# EasyEDA Pro project CH32V307VCT6开源最小系统.eprj, board PCB1
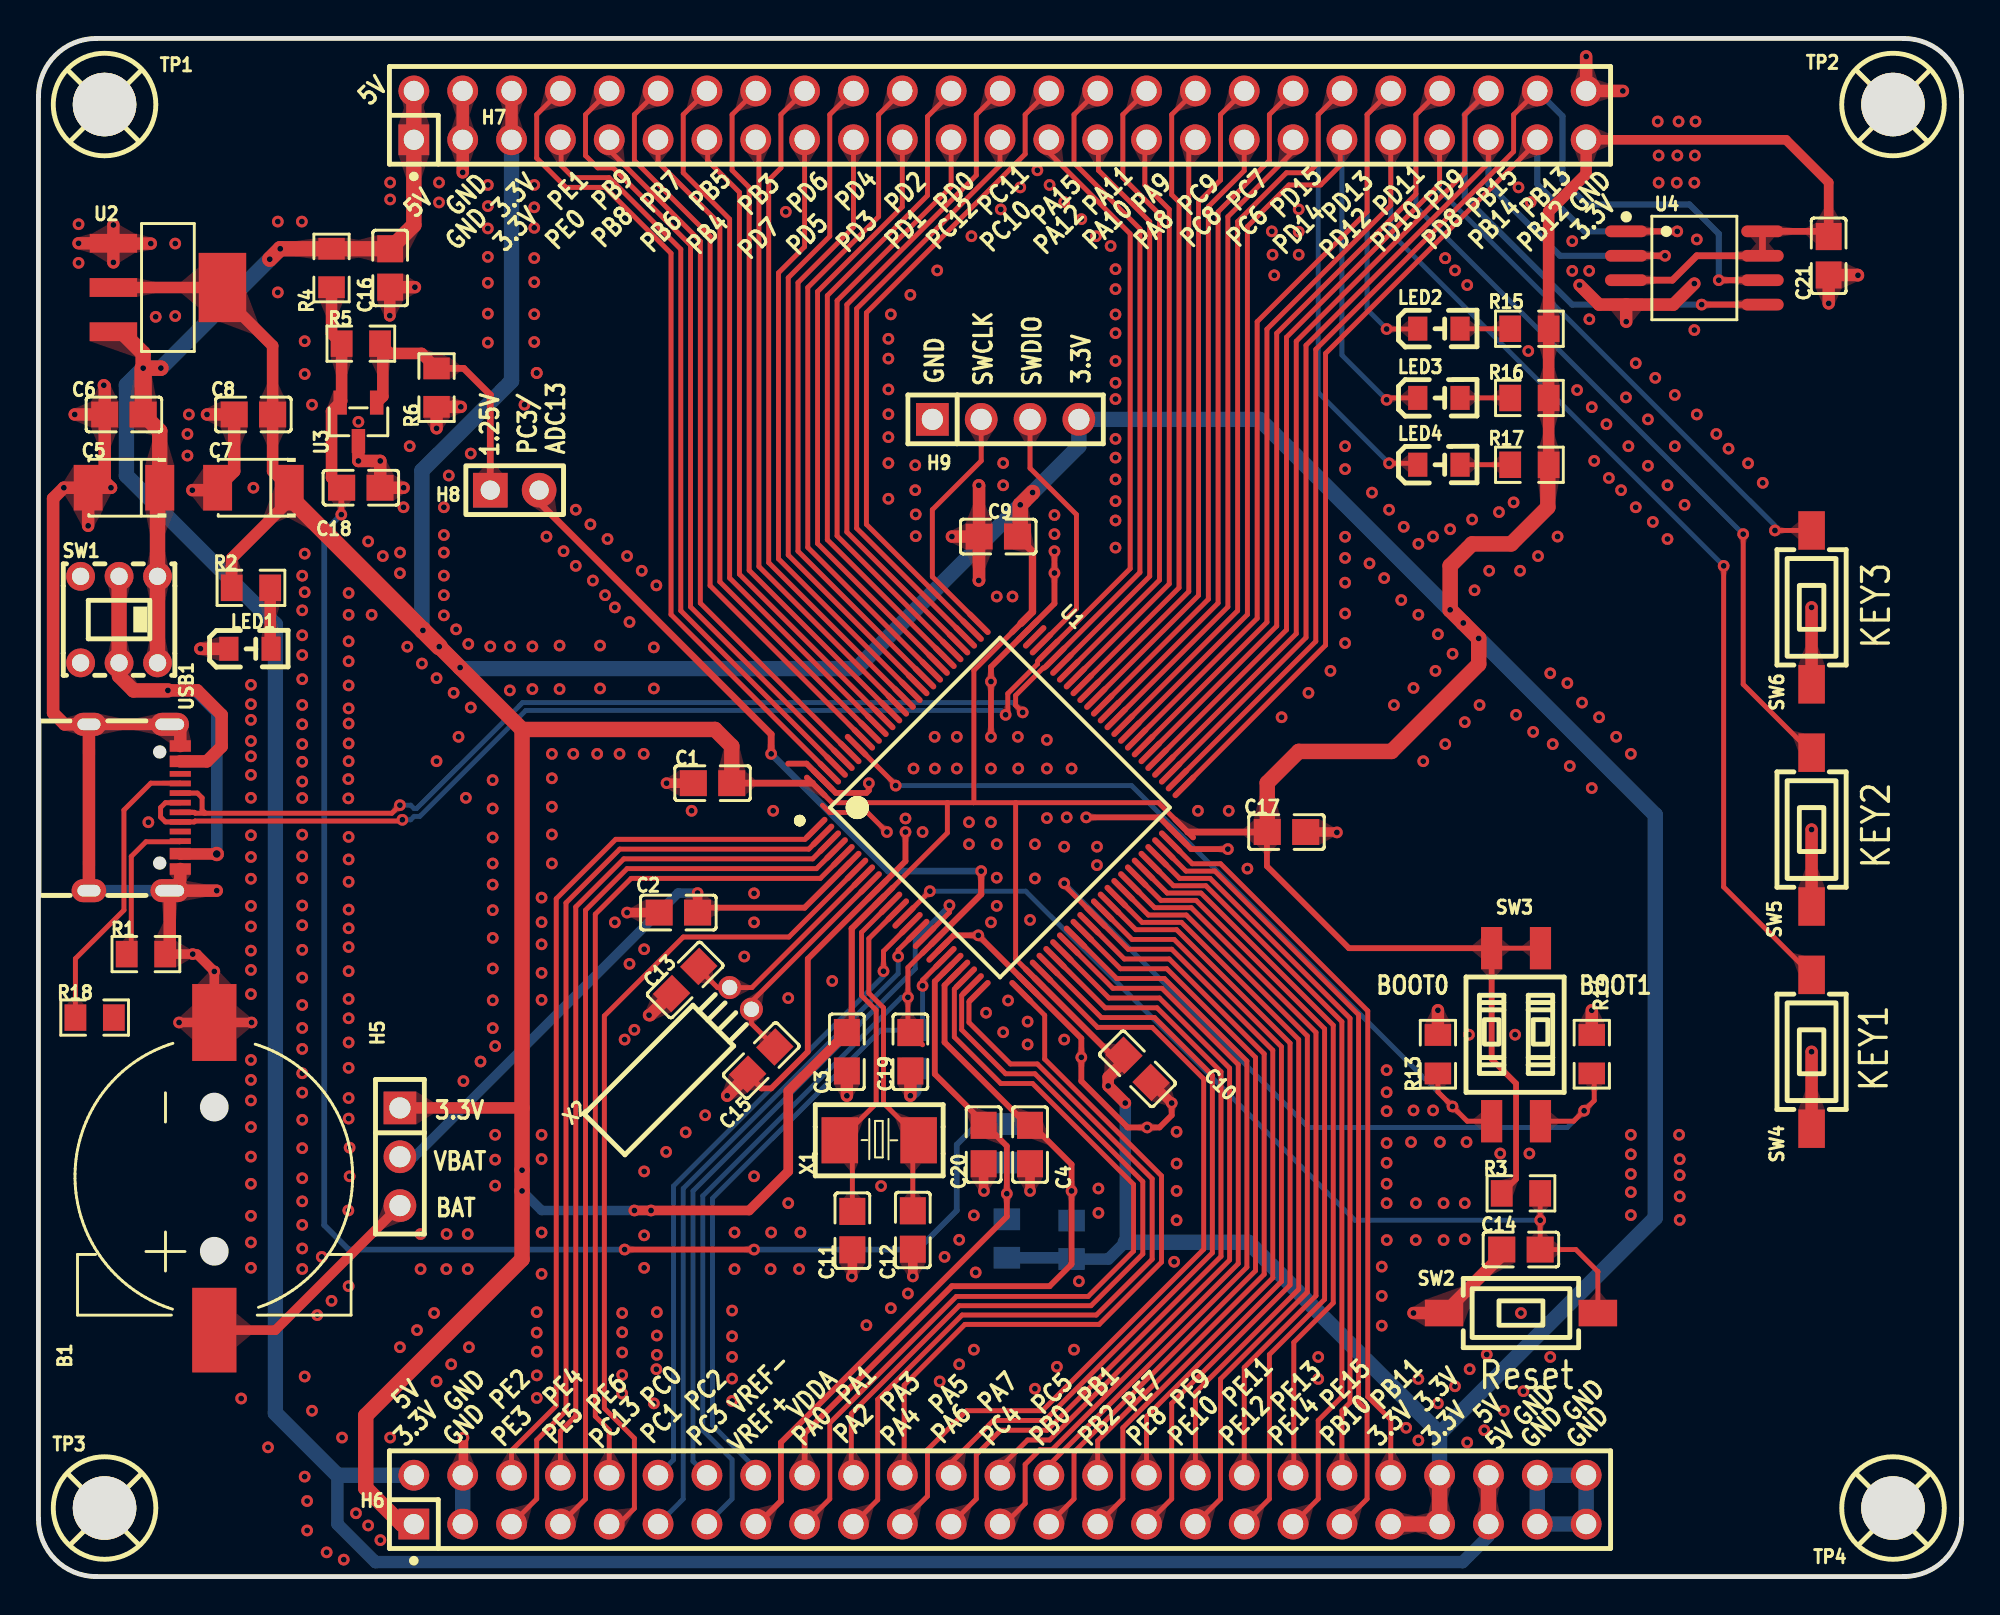
[diagram p1: board, top side]
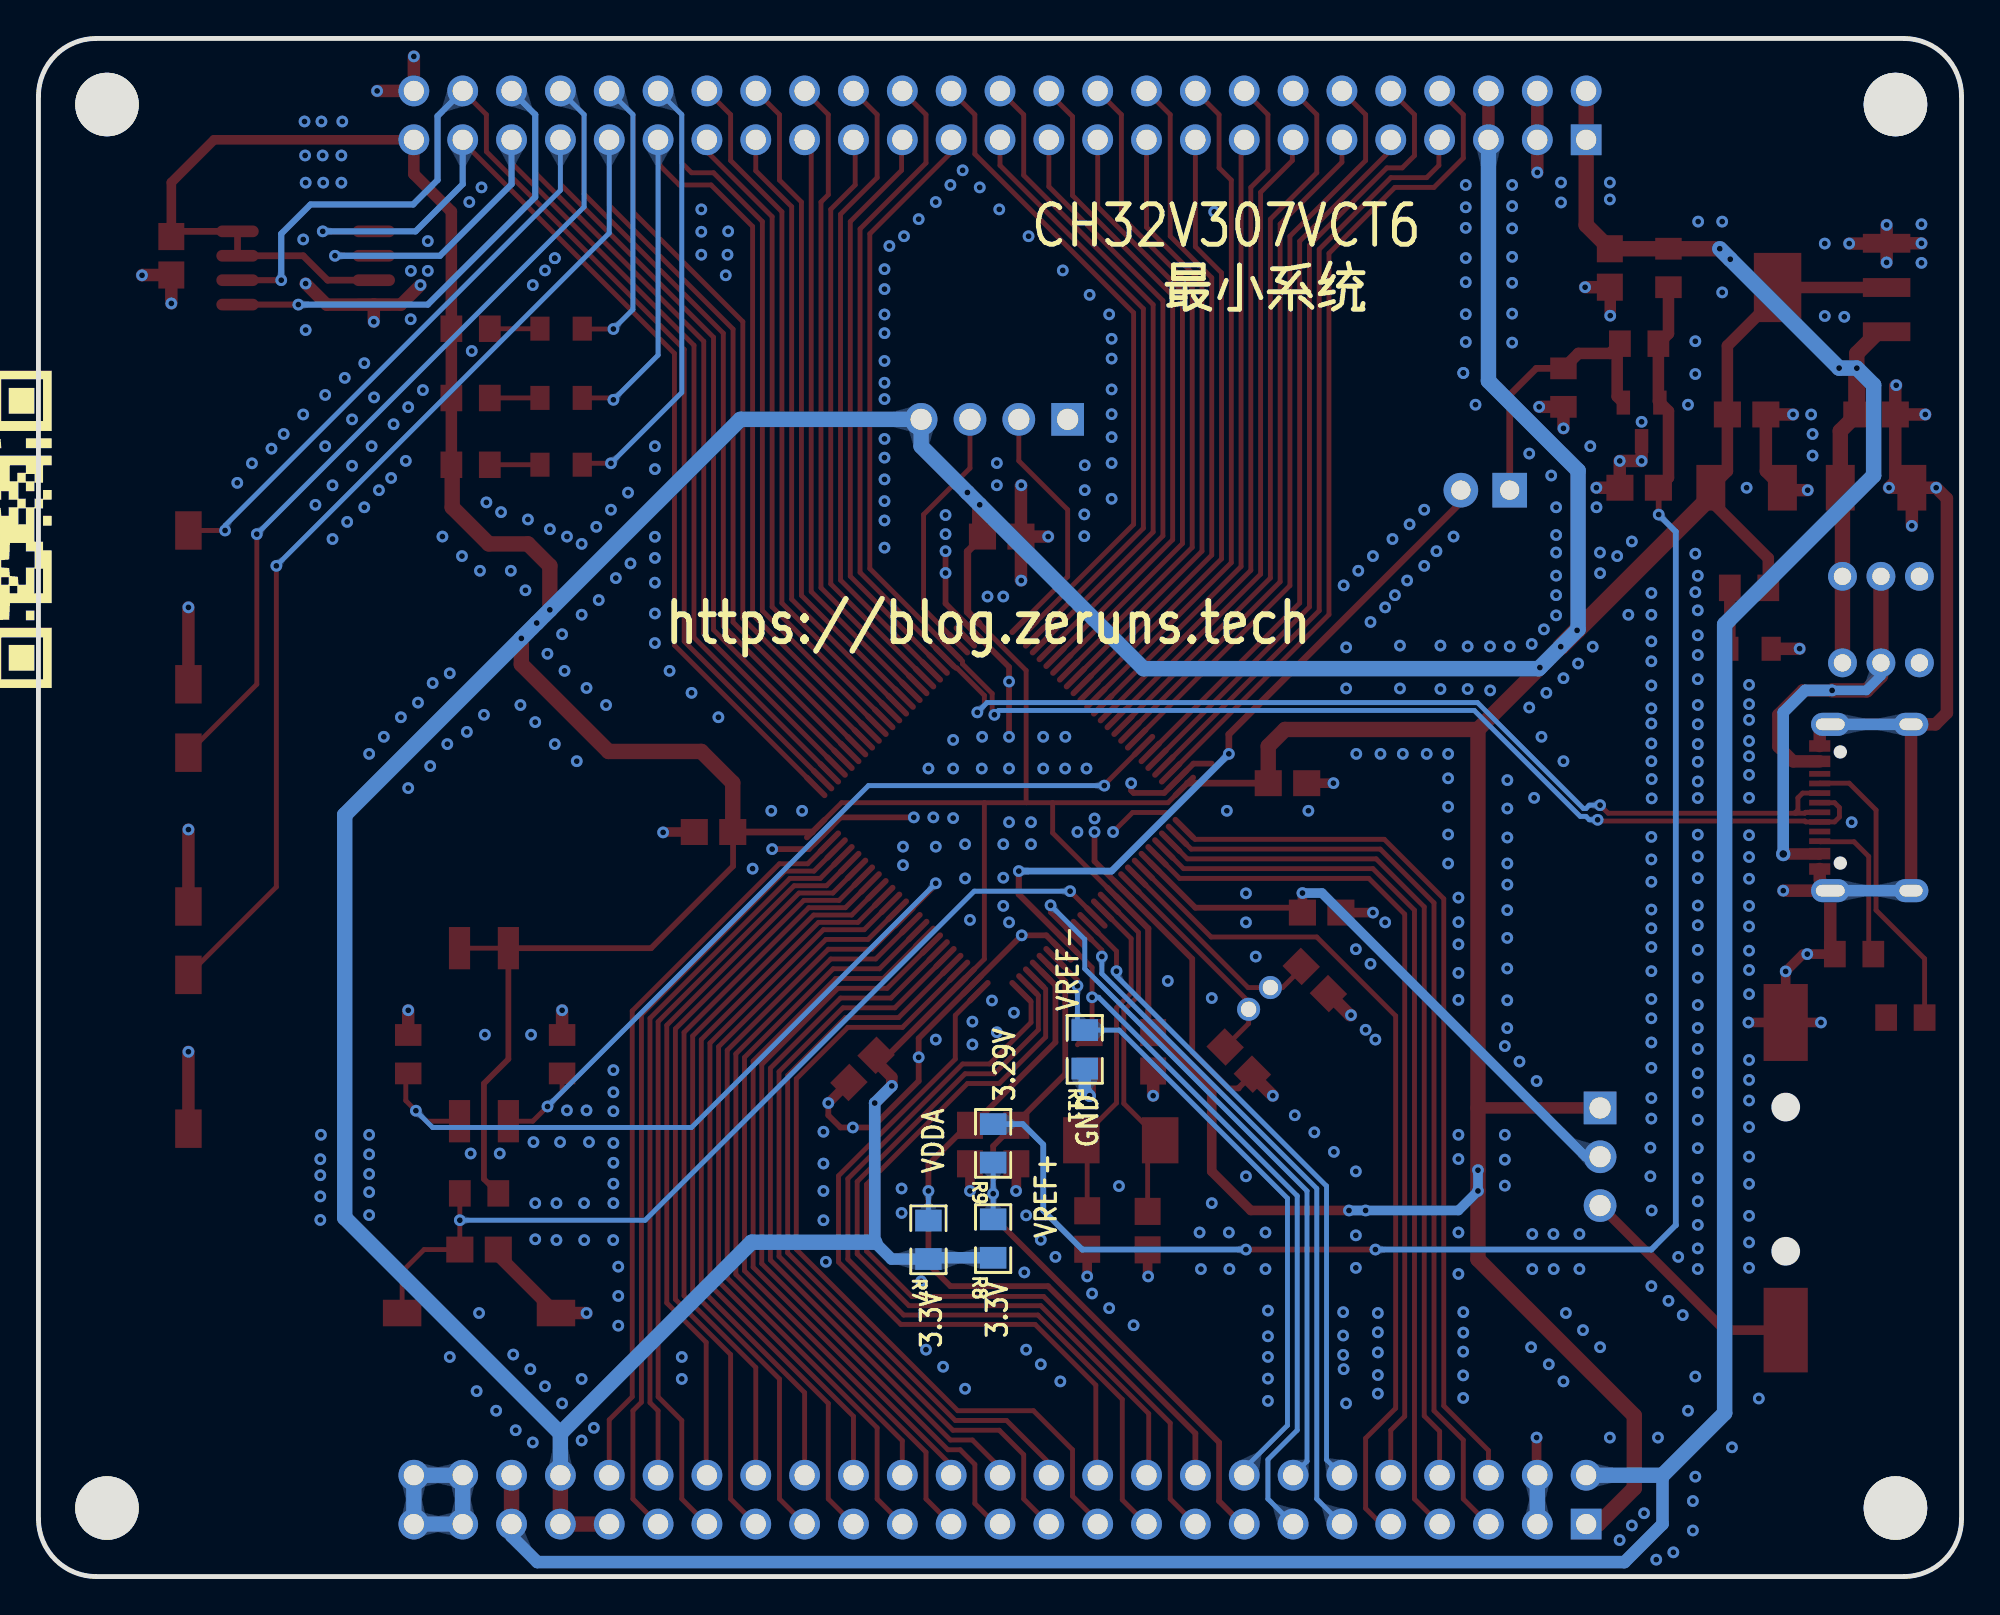
[diagram p2: board, bottom side, seen from below]

Outline 100 x 80 mm; copper layers: Top Layer, Bottom Layer. Coordinates in mm from the lower left corner of the outline.
Outline path: 0,77 0,3 arc(0.88,0.88) 3,0 97,0 arc(99.12,0.88) 100,3 100,77 arc(99.12,79.12) 97,80 3,80 arc(0.88,79.12) 0,77
Stack: Top Layer 0.035mm / Dielectric1 1.51mm FR4 er 4.5 / Bottom Layer 0.035mm

## Design rules (mm)
template: 自定义配置
spacing copperThickness1oz (default): track to track 0.102, other pairs 0.152 to 0.3
spacing copperThickness2oz: track to track 0.203, other pairs 0.152 to 0.3
track width copperThickness1oz (default): min 0.127, default 0.254, max 2.54
track width copperThickness2oz: min 0.203, default 0.254, max 2.54
differential pair differentialPair (default): width min 0.127, default 0.254, max 2.54; gap min 0.152, default 0.152
via viaSize (default): diameter min 0.5, default 0.61, max 10; hole min 0.3, default 0.305, max 6.3

## Placement (name value [footprint] x y rotation side)
B1  CR1220-2  [BAT-SMD_CR1220-2]  9.14 20.82 90 top
C1  100nF  [C0805]  35.05 41.27 0 top
C2  100nF  [C0805]  33.27 34.53 0 top
C3  100nF  [C0805]  42.04 27.3 90 top
C4  100nF  [C0805]  51.56 22.47 90 top
C5  47uF  [CASE-B_3528]  4.44 56.63 180 top
C6  100nF  [C0805]  4.44 60.44 0 top
C7  47uF  [CASE-B_3528]  11.18 56.63 180 top
C8  100nF  [C0805]  11.18 60.44 0 top
C9  100nF  [C0805]  49.91 54.09 0 top
C10  100nF  [C0805]  57.15 26.41 135 top
C11  20pF  [C0805]  42.32 17.99 90 top
C12  20pF  [C0805]  45.47 18.02 90 top
C13  12pF  [C0805]  33.63 31.03 45 top
C14  100nF  [C0805]  77.09 17.01 0 top
C15  12pF  [C0805]  37.58 26.84 45 top
C16  100nF  [C0805]  18.29 68.06 90 top
C17  100nF  [C0805]  64.9 38.72 180 top
C18  100nF  [C0805]  16.76 56.63 180 top
C19  100nF  [C0805]  45.34 27.3 90 top
C20  100nF  [C0805]  49.15 22.47 90 top
C21  100nF  [C0805]  93.09 68.7 90 top
H5  -  [HDR-TH_3P-P2.54-V-M]  18.8 21.83 270 top
H6  X6521WV-2x25H-C30D60  [HDR-TH_50P-2.54-V-M-R2-C25-S2.54]  50 4 0 top
H7  X6521WV-2x25H-C30D60  [HDR-TH_50P-2.54-V-M-R2-C25-S2.54]  50 76 0 top
H8  -  [HDR-TH_2P-P2.54-V-M-1]  24.77 56.5 0 top
H9  -  [HDR-TH_4P-P2.54-V-M]  50.29 60.19 0 top
LED1  NCD0805R1  [LED_0805]  11.05 48.25 0 top
LED2  NCD0805R1  [LED_0805]  72.87 64.9 0 top
LED3  NCD0805R1  [LED_0805]  72.87 61.3 0 top
LED4  NCD0805R1  [LED_0805]  72.87 57.83 0 top
R1  5.1kΩ  [R0805]  5.59 32.38 0 top
R2  330Ω  [R0805]  11.05 51.42 0 top
R3  10kΩ  [R0805]  77.09 19.93 180 top
R4  470Ω  [R0805]  15.24 68.06 270 top
R5  1.8K  [R0805]  16.76 64.12 180 top
R6  1.1K  [R0805]  20.7 61.84 90 top
R7  0Ω  [R0805]  53.72 17.52 90 bottom
R8  0Ω  [R0805]  50.36 17.58 90 bottom
R9  0Ω  [R0805]  50.36 22.53 90 bottom
R11  0Ω  [R0805]  45.59 27.42 90 bottom
R13  10kΩ  [R0805]  72.77 27.17 270 top
R14  10kΩ  [R0805]  80.77 27.17 270 top
R15  330Ω  [R0805]  77.53 64.9 180 top
R16  330Ω  [R0805]  77.53 61.3 180 top
R17  330Ω  [R0805]  77.53 57.83 180 top
R18  5.1kΩ  [R0805]  2.92 29.07 0 top
SW1  PS-5850A-6PL  [SW-TH_6P-L5.8-W5.8-P2.00-LS4.5-BL]  4.19 49.77 0 top
SW2  TSA363G25-250B  [SW-SMD_L6.1-W3.6-LS8.0]  77.09 13.71 0 top
SW3  DSIC02LSGET  [SW-SMD_4P-L6.0-W5.1-P2.54-LS9.3-BL]  76.84 28.18 0 top
SW4  TSA363G25-250B  [SW-SMD_L6.1-W3.6-LS8.0]  92.2 27.3 90 top
SW5  TSA363G25-250B  [SW-SMD_L6.1-W3.6-LS8.0]  92.2 38.85 90 top
SW6  TSA363G25-250B  [SW-SMD_L6.1-W3.6-LS8.0]  92.2 50.41 90 top
TP1  -  [m3螺丝]  3.5 76.5 0 top
TP2  -  [m3螺丝]  96.5 76.5 0 top
TP3  -  [m3螺丝]  3.5 3.5 0 top
TP4  -  [m3螺丝]  96.5 3.5 0 top
U1  CH32V307VCT6  [LQFP-100_L14.0-W14.0-P0.50-LS16.0-BL]  50 40 315 top
U2  AMS1117-3.3  [SOT-223-4_L6.5-W3.5-P2.30-LS7.0-BR]  6.73 67.05 180 top
U3  TL432  [SOT-23-3_L2.9-W1.3-P1.90-LS2.4-BR]  16.64 60.06 90 top
U4  W25Q64JVSSIQ  [SOP-8_L5.3-W5.3-P1.27-LS8.0-BL]  86.11 68.06 270 top
USB1  TYPE-C 16PIN 2MD(073)  [USB-C-SMD_TYPE-C-6PIN-2MD-073]  5 40 270 top
X1  8MHz  [CRYSTAL-SMD_L5.0-W3.2]  43.72 22.69 180 top
X2  32.768kHz  [OSC-TH_BD3.1-P0.8-D0.3]  36.51 30.07 45 top

## Footprints (pads in the part's own frame, mm; a bottom-side part is the same pattern mirrored in y, then rotated)
BAT-SMD_CR1220-2
  rect 4.4x2.3 smd: 1(-8,0)
  rect 4x2.3 smd: 2(8,0)
C0805
  rect 1.41x1.35 smd: 1(-1,0) 2(1,0)
CASE-B_3528
  rect 1.506x2.376 smd: 1(-1.861,0) 2(1.861,0)
CRYSTAL-SMD_L5.0-W3.2
  rect 1.9x2.4 smd: 1(-2.05,0) 2(2.05,0)
HDR-TH_2P-P2.54-V-M-1
  rect 1.8x1.8 hole 1: 1(-1.27,0)
  round 1.8 hole 1: 2(1.27,0)
HDR-TH_3P-P2.54-V-M
  rect 1.7x1.7 hole 1.1: 1(-2.54,0)
  round 1.7 hole 1.1: 2(0,0) 3(2.54,0)
HDR-TH_4P-P2.54-V-M
  rect 1.7x1.7 hole 1.1: 1(-3.81,0)
  round 1.7 hole 1.1: 2(-1.27,0) 3(1.27,0) 4(3.81,0)
HDR-TH_50P-2.54-V-M-R2-C25-S2.54
  rect 1.6x1.6 hole 1.05: 1(-30.48,-1.27)
  round 1.6 hole 1.05: 2(-30.48,1.27) 3(-27.94,-1.27) 4(-27.94,1.27) 5(-25.4,-1.27) 6(-25.4,1.27) 7(-22.86,-1.27) 8(-22.86,1.27) 9(-20.32,-1.27) 10(-20.32,1.27) 11(-17.78,-1.27) 12(-17.78,1.27) 13(-15.24,-1.27) 14(-15.24,1.27) 15(-12.7,-1.27) 16(-12.7,1.27) 17(-10.16,-1.27) 18(-10.16,1.27) 19(-7.62,-1.27) 20(-7.62,1.27) 21(-5.08,-1.27) 22(-5.08,1.27) 23(-2.54,-1.27) 24(-2.54,1.27) 25(0,-1.27) 26(0,1.27) 27(2.54,-1.27) 28(2.54,1.27) 29(5.08,-1.27) 30(5.08,1.27) 31(7.62,-1.27) 32(7.62,1.27) 33(10.16,-1.27) 34(10.16,1.27) 35(12.7,-1.27) 36(12.7,1.27) 37(15.24,-1.27) 38(15.24,1.27) 39(17.78,-1.27) 40(17.78,1.27) 41(20.32,-1.27) 42(20.32,1.27) 43(22.86,-1.27) 44(22.86,1.27) 45(25.4,-1.27) 46(25.4,1.27) 47(27.94,-1.27) 48(27.94,1.27) 49(30.48,-1.27) 50(30.48,1.27)
LED_0805
  rect 1x1.25 smd: 1(-1.15,0.005) 2(1.05,0.005)
LQFP-100_L14.0-W14.0-P0.50-LS16.0-BL
  oval 0.3x1.6 smd: 1(-6,-7.55) 2(-5.5,-7.55) 3(-5,-7.55) 4(-4.5,-7.55) 5(-4,-7.55) 6(-3.5,-7.55) 7(-3,-7.55) 8(-2.5,-7.55) 9(-2,-7.55) 10(-1.5,-7.55) 11(-1,-7.55) 12(-0.5,-7.55) 13(0,-7.55) 14(0.5,-7.55) 15(1,-7.55) 16(1.5,-7.55) 17(2,-7.55) 18(2.5,-7.55) 19(3,-7.55) 20(3.5,-7.55) 21(4,-7.55) 22(4.5,-7.55) 23(5,-7.55) 24(5.5,-7.55) 25(6,-7.55) 51(6,7.55) 52(5.5,7.55) 53(5,7.55) 54(4.5,7.55) 55(4,7.55) 56(3.5,7.55) 57(3,7.55) 58(2.5,7.55) 59(2,7.55) 60(1.5,7.55) 61(1,7.55) 62(0.5,7.55) 63(0,7.55) 64(-0.5,7.55) 65(-1,7.55) 66(-1.5,7.55) 67(-2,7.55) 68(-2.5,7.55) 69(-3,7.55) 70(-3.5,7.55) 71(-4,7.55) 72(-4.5,7.55) 73(-5,7.55) 74(-5.5,7.55) 75(-6,7.55)
  oval 1.6x0.3 smd: 26(7.55,-6) 27(7.55,-5.5) 28(7.55,-5) 29(7.55,-4.5) 30(7.55,-4) 31(7.55,-3.5) 32(7.55,-3) 33(7.55,-2.5) 34(7.55,-2) 35(7.55,-1.5) 36(7.55,-1) 37(7.55,-0.5) 38(7.55,0) 39(7.55,0.5) 40(7.55,1) 41(7.55,1.5) 42(7.55,2) 43(7.55,2.5) 44(7.55,3) 45(7.55,3.5) 46(7.55,4) 47(7.55,4.5) 48(7.55,5) 49(7.55,5.5) 50(7.55,6) 76(-7.55,6) 77(-7.55,5.5) 78(-7.55,5) 79(-7.55,4.5) 80(-7.55,4) 81(-7.55,3.5) 82(-7.55,3) 83(-7.55,2.5) 84(-7.55,2) 85(-7.55,1.5) 86(-7.55,1) 87(-7.55,0.5) 88(-7.55,0) 89(-7.55,-0.5) 90(-7.55,-1) 91(-7.55,-1.5) 92(-7.55,-2) 93(-7.55,-2.5) 94(-7.55,-3) 95(-7.55,-3.5) 96(-7.55,-4) 97(-7.55,-4.5) 98(-7.55,-5) 99(-7.55,-5.5) 100(-7.55,-6)
m3螺丝
  round 3.3 hole 3.3: 1(-0.064,0.064)
OSC-TH_BD3.1-P0.8-D0.3
  round 1.2 hole 0.8: 1(0,0.8) 2(0,-0.8)
R0805
  rect 1.133x1.377 smd: 1(-1,0) 2(1,0)
SOP-8_L5.3-W5.3-P1.27-LS8.0-BL
  oval 0.609x2.204 smd: 1(-1.905,-3.542) 2(-0.635,-3.542) 3(0.635,-3.542) 4(1.905,-3.542) 5(1.905,3.542) 6(0.635,3.542) 7(-0.635,3.542) 8(-1.905,3.542)
SOT-23-3_L2.9-W1.3-P1.90-LS2.4-BR
  rect 1.25x0.7 smd: 1(1,-0.95) 2(1,0.95) 3(-1,0)
SOT-223-4_L6.5-W3.5-P2.30-LS7.0-BR
  rect 2.47x0.98 smd: 1(2.835,-2.3) 2(2.835,0) 3(2.835,2.3)
  rect 2.47x3.6 smd: 4(-2.835,0)
SW-SMD_4P-L6.0-W5.1-P2.54-LS9.3-BL
  rect 1.1x2.2 smd: 1(-1.27,-4.5) 2(1.27,-4.5) 3(1.27,4.5) 4(-1.27,4.5)
SW-SMD_L6.1-W3.6-LS8.0
  rect 2x1.38 smd: 1(-4,0) 2(4,0)
SW-TH_6P-L5.8-W5.8-P2.00-LS4.5-BL
  round 1.5 hole 0.9: 1(-2,-2.25) 2(0,-2.25) 3(2,-2.25) 4(-2,2.25) 5(0,2.25) 6(2,2.25)
USB-C-SMD_TYPE-C-6PIN-2MD-073
  rect 0.6x1.1 smd: 1(-3.2,2.375) 2(-2.4,2.375) 11(2.4,2.375) 12(3.2,2.375)
  rect 0.3x1.1 smd: 3(-1.75,2.375) 4(-1.25,2.375) 5(-0.75,2.375) 6(-0.25,2.375) 7(0.25,2.375) 8(0.75,2.375) 9(1.25,2.375) 10(1.75,2.375)
  oval 1.2x2 hole 0.6x1.5: 13(-4.325,1.825) 14(4.325,1.825)
  oval 1.2x1.8 hole 0.6x1.2: 13(-4.325,-2.375) 14(4.325,-2.375)

## Nets
As in the schematic.

Pads without a net: SW1 1 4; TP1 1; TP2 1; TP3 1; TP4 1; U1 73; USB1 3 9

## Via types
v1: diameter 0.61, hole 0.305, Top Layer to Bottom Layer, 651 vias
v2: diameter 0.75, hole 0.4, Top Layer to Bottom Layer, 1 via

## Routing (per net, layer and track width the routed paths; a pad name or vN(x,y) marks a point on that pad's centre or on a via; arc(x,y) is an arc through that point)
1.25V: length 15.5
  Top Layer w0.35: R6.2 22.11,62.84 23.5,61.46 23.5,55.87
  Top Layer w0.6: 17.91,63.98 17.91,61.38 U3.1 ; 17.91,63.98 R5.1 ; 17.91,63.98 18.27,63.62 19.92,63.62 R6.2
3.29V: length 90.5
  Top Layer w0.3: v1(15.75,55.23) 15.75,56.62 C18.2 ; v1(37.21,17.01) v1(30.48,17.01)
  Top Layer w0.6: C18.2 15.24,57.16 15.24,60.61 U3.2 15.76,61.14 R5.2 15.24,64.65 R4.2
  Bottom Layer w0.3: R9.2 48.82,23.53 47.75,22.47 47.75,19.04 45.72,17.01 v1(37.21,17.01) ; v1(30.48,17.01) 16.13,17.01 14.86,18.28 14.86,54.35 v1(15.75,55.23)
+3.3V: length 509.6
  Top Layer w0.254: U1.28 50.81,32.12 50.81,40.25 ; 78.1,32.68 SW3.4 ; U1.11 47.26,38.68 47.26,40.25 ; 48.62,40.25 50.81,40.25 ; 48.62,40.25 48.64,40.27 48.64,47.13 51.1,49.58 ; 48.62,40.25 47.26,40.25 ; 50.81,40.25 58.24,40.25 59.58,38.9 ; 40.42,41.1 41.27,40.25 47.26,40.25
  Top Layer w0.3: C17.2 63.88,38.71 63.88,36.95 68.14,32.68 SW3.4 75.56,26.91 76.84,25.64 76.84,20.68 R3.2
  Top Layer w0.32: U1.28 55.98,26.95 56.6,26.95 ; 42.29,28.3 42.29,33.7 U1.11
  Top Layer w0.35: 82.56,67.43 84.96,67.43 86.23,68.7 U4.7 U4.8 92.57,69.97 93.09,69.44 ; 59.76,38.72 C17.2 ; C1.2 40.25,41.27
  Top Layer w0.38: C9.2 51.69,53.31 51.69,50.17 51.1,49.58
  Top Layer w0.5: v1(30.99,19.04) v1(31.85,19.04) 36.96,19.04 38.99,21.07 38.99,25.25 C3.2 ; H7.49 90.87,74.73 93.09,72.51 93.09,69.44
  Top Layer w0.6: U2.2 U2.4 9.57,66.62 12.18,64.01 C8.2 12.18,57.49 C7.1 13.04,55.95 10.05,52.97 R2.1 ; R17.1 R16.1 R15.1 78.53,71 80.48,72.95 H7.49 ; 25.15,24.37 H5.1 ; v1(56.51,24.63) v1(55.63,25.52) 55.63,25.98 56.6,26.95
  Top Layer w0.65: H7.5 H7.6
  Top Layer w0.8: C17.2 63.9,41.28 65.53,42.92 70.36,42.92 74.89,47.45 v1(74.89,48.8) v1(74.09,49.6) v1(73.41,50.28) 73.41,52.57 74.55,53.71 76.58,53.71 78.49,55.62 78.49,57.78 R17.1 ; C1.2 36.05,43.19 35.18,44.06 25.15,44.06 ; 25.15,44.06 v1(21.93,47.28) v1(20.84,48.36) ; 25.15,44.06 v1(25.15,21.14) v1(25.15,20.06) 25.15,16.5 17.02,8.37 17.02,4.6 18.89,2.73 H6.1 ; C9.2 51.05,54.23 v1(51.05,55.74) v1(51.7,56.38) ; H6.41 H6.43 H6.44
  Top Layer w0.9: 13.04,56.17 v1(19.99,49.21) v1(20.84,48.36)
  Bottom Layer w0.5: 25.15,21.07 v1(25.15,20.06) 26.16,19.04 v1(30.99,19.04) v1(31.85,19.04)
  Bottom Layer w0.6: v1(55.63,25.52) v1(56.51,24.63) 56.51,17.39 55.64,16.52 R7.1 53.66,16.58 R8.1
  Bottom Layer w0.8: H7.5 24.6,62.18 19.94,57.52 19.94,49.27 20.83,48.38 ; 72.86,7.44 84.07,18.66 84.07,39.61 v1(74.89,48.8) v1(74.09,49.6) v1(73.41,50.28) 63.5,60.19 H9.4 54.1,58.79 v1(51.7,56.38) v1(51.05,55.74) 42.53,47.22 21.98,47.22 v1(21.93,47.28) v1(20.84,48.36) ; 72.86,7.44 62.92,17.39 56.51,17.39 ; 72.86,7.44 H6.44
+5V: length 177.7
  Top Layer w0.8: v1(12.03,68.52) v1(12.57,69.06) R4.1 C16.2 19.52,70.29 H7.1 H7.2 ; U2.3 4.32,64.75 5.44,63.62 v1(5.44,62.85) 6.36,62.85 v1(6.37,62.86) ; H6.46 H6.45 ; C6.2 6.31,59.58 C5.1 6.19,56.52 SW1.6 SW1.3
  Top Layer w0.9: C6.2 v1(5.44,62.85)
  Bottom Layer w0.65: 15.55,5.27 15.55,2.73 17.53,0.75 74.06,0.75 75.4,2.09 H6.45
  Bottom Layer w0.8: H6.2 15.55,5.27 12.32,8.5 12.32,49.52 4.57,57.27 4.57,61.98 v1(5.44,62.85) ; v1(12.57,69.06) v1(12.03,68.52) v1(6.37,62.86) 5.46,62.86
GND: length 233.1
  Top Layer w0.254: 40.77,40.12 41.15,39.74 43.1,39.74 v1(44.12,38.72)
  Top Layer w0.3: v1(43.18,41.27) 43.18,40.88 43.05,40.76 41.46,40.76 U1.99 39.94,42.28 38.99,42.28 ; v1(54.48,39.49) 58.29,39.49 U1.49 59.94,37.84 v1(61.85,37.84) ; v1(58.93,24.63) 58.93,23.99 58.29,23.36 v1(57.65,23.36) 56.64,23.36 54.23,25.77 v1(54.23,27.01) 54.23,27.99 U1.27 v1(48.87,33.35) 47.59,33.35 U1.19 ; 36.88,26.13 37.59,25.41 37.59,25.39 38.1,25.39 40,27.3 40,32.13 U1.10 45.09,37.21 v1(45.09,38.72) ; v1(49.53,43.68) v1(49.53,46.55) 49.53,47.31 U1.74 52.83,50.61 v1(52.83,52.2) v1(52.83,53.33)
  Top Layer w0.5: B1.2 v1(9.14,31.47) 8.24,32.38 v1(8.02,32.38) R1.2 ; B1.2 v1(7.31,28.82) ; B1.2 v1(11.08,28.82) ; C12.1 v1(45.47,15.61) ; C4.1 v1(51.56,20.06) ; v1(49.17,20.06) 49.15,20.07 C20.1 ; C1.1 v1(32.66,41.27) ; C11.1 42.32,15.64 v1(42.3,15.61) ; v1(67.52,38.7) 67.5,38.72 C17.1 ; v1(22.1,7.23) 22.1,5.31 H6.4 ; 57.86,25.7 v1(58.93,24.63) ; C2.1 v1(30.61,34.53)
  Top Layer w0.6: v1(18.27,65.58) 18.27,67.04 C16.1 ; USB1.13 USB1.13 ; 7.38,36.22 USB1.14
  Top Layer w0.65: C19.1 v1(45.34,25.01) ; v1(82.56,65.27) U4.4 ; U4.4 85.01,66.16 v1(86.11,67.25) ; U4.4 81.15,66.16 v1(80.14,67.17) ; LED1.1 8.43,48.25 v1(8.42,48.26) ; v1(22.06,73.03) H7.3 H7.4 ; v1(1.89,60.44) C6.1 ; C6.1 3.44,56.96 v1(3.77,56.63) C5.2 ; C6.1 3.44,61.92 v1(3.4,61.96) ; USB1.12 7.38,36.22 ; 17.77,56.64 v1(17.77,58.03) v1(16.64,58.03) U3.3 ; 17.77,56.64 C18.1 ; 17.77,56.64 17.78,56.63 v1(18.99,56.63) ; C9.1 48.91,56.74 v1(48.9,56.76) ; C9.1 48.91,51.82 v1(48.9,51.81) ; C9.1 v1(47.5,54.09) ; v1(19.58,67.06) C16.1 ; R13.1 v1(72.77,29.45) ; R14.1 v1(80.77,29.45) ; v1(2.58,54.65) C5.2 ; C5.2 v1(1.32,56.63) 0.76,56.07 0.76,44.92 1.36,44.33 USB1.13 USB1.14 ; C14.1 76.09,16.71 SW2.1 v1(71.5,13.71) ; v1(31.75,29.2) 31.8,29.2 32.92,30.32 ; v1(80.48,79.06) H7.50 v1(82.39,77.27) ; v1(9.27,35.67) USB1.14 6.83,32.61 R1.2 ; U2.1 v1(2.08,69.35) ; U2.1 3.91,69.33 v1(5.84,69.33) ; U2.1 v1(3.9,68.35) ; U2.1 v1(3.9,70.3) ; v1(21.96,60.84) R6.1 v1(20.7,59.72) ; v1(8,56.5) 9.19,56.5 C7.2 10.18,57.49 C8.1 v1(8.76,60.44) ; C3.1 v1(42.04,25.01) ; SW4.1 v1(92.2,27.3) ; v1(35.81,25.01) 36.88,26.07 36.88,26.13 ; SW6.1 v1(92.2,50.41) ; v1(93.09,66.22) C21.1 94.6,67.7 v1(94.62,67.68) ; USB1.1 7.38,44.44 ; SW5.1 v1(92.2,38.85)
  Bottom Layer w0.6: USB1.13 USB1.13 ; USB1.14 USB1.14
  Bottom Layer w0.65: R11.1 45.59,25.26 v1(45.34,25.01)
  Bottom Layer w0.8: H6.3 H6.4 ; H6.47 H6.48 H6.50 H6.49 H6.47
  vias: v1(2.08,70.34) v1(2.08,68.33) v1(5.72,39.23) v1(6.1,65.52) v1(7.11,69.33) v1(7.11,65.56) v1(7.75,59.43) v1(7.75,58.3) v1(7.82,60.44) v1(10.54,9.26) v1(11.05,46.38) v1(11.05,45.38) v1(11.05,44.56) v1(11.05,43.46) v1(11.05,42.66) v1(11.05,41.7) v1(11.05,40.5) v1(11.05,38.56) v1(11.05,37.43) v1(11.05,36.29) v1(11.05,34.88) v1(11.05,33.81) v1(11.05,32.56) v1(11.05,31.55) v1(11.05,30.29) v1(11.05,26.87) v1(11.05,25.83) v1(11.05,24.76) v1(11.05,23.38) v1(11.05,21.84) v1(11.05,20.43) v1(11.05,18.76) v1(11.05,17.38) v1(11.05,16.06) v1(11.18,56.63) v1(11.94,6.72) v1(12.45,70.47) v1(12.45,66.79) v1(13.7,70.47) v1(13.72,52.06) v1(13.72,50.26) v1(13.72,48.96) v1(13.72,47.93) v1(13.72,46.67) v1(13.72,45.33) v1(13.72,44.33) v1(13.72,43.3) v1(13.72,42.38) v1(13.72,41.35) v1(13.72,40.49) v1(13.72,38.59) v1(13.72,37.46) v1(13.72,36.33) v1(13.72,34.9) v1(13.72,33.87) v1(13.72,32.6) v1(13.72,31.15) v1(13.72,29.73) v1(13.72,28.53) v1(13.72,27.44) v1(13.72,26.18) v1(13.72,25.17) v1(13.72,23.76) v1(13.72,22.28) v1(13.72,20.72) v1(13.72,19.52) v1(13.72,18.29) v1(13.72,17.06) v1(13.72,16) v1(13.84,64.25) v1(13.84,62.55) v1(13.84,53.2) v1(13.84,51.2) v1(13.84,10.4) v1(13.84,5.2) v1(13.97,3.93) v1(13.97,2.4) v1(14.22,60.95) v1(14.22,8.63) v1(14.5,13.6) v1(14.73,16.63) v1(14.99,1.26) v1(15.24,14.34) v1(15.79,7.23) v1(15.88,0.88) v1(16.13,51.16) v1(16.13,50.03) v1(16.13,48.64) v1(16.13,47.61) v1(16.13,46.35) v1(16.13,45.16) v1(16.13,44.37) v1(16.13,43.33) v1(16.13,42.41) v1(16.11,41.48) v1(16.11,40.47) v1(16.13,38.47) v1(16.13,37.3) v1(16.13,36.14) v1(16.13,34.69) v1(16.13,33.72) v1(16.13,32.74) v1(16.13,31.49) v1(16.13,30.04) v1(16.13,29.04) v1(16.13,27.78) v1(16.13,26.46) v1(16.13,24.89) v1(16.13,23.82) v1(16.11,19.04) v1(16.13,15.1) v1(16.18,22.31) v1(16.18,20.82) v1(16.51,3.29) v1(16.64,60.06) v1(17.14,53.84) v1(17.14,2.66) v1(17.33,50.03) v1(17.78,1.9) v1(17.91,53.08) v1(18.29,72.51) v1(18.29,71.63) v1(18.29,7.23) v1(18.8,53.26) v1(18.8,52.19) v1(18.8,11.93) v1(18.98,55.62) v1(19.18,48.36) v1(19.3,58.79) v1(19.69,12.82) v1(19.94,47.49) v1(19.87,17.81) v1(19.87,15.99) v1(20.57,13.71) v1(20.7,46.73) v1(20.7,42.41) v1(20.7,10.15) v1(20.83,72.51) v1(20.83,71.47) v1(21.08,55.62) v1(21.08,54.17) v1(21.08,53.26) v1(21.08,52.06) v1(21.08,51.04) v1(21.08,49.99) v1(21.22,17.81) v1(21.21,15.99) v1(21.34,57.27) v1(21.46,11.04) v1(21.59,45.96) v1(21.72,49.27) v1(21.84,43.68) v1(22.1,25.77) v1(22.22,40.5) v1(22.32,17.81) v1(22.32,15.99) v1(22.35,48.5) v1(22.38,11.93) v1(22.48,58.41) v1(22.48,45.2) v1(22.99,26.79) v1(23.37,72.38) v1(23.37,71.28) v1(23.37,70.12) v1(23.37,68.64) v1(23.37,67.29) v1(23.37,65.69) v1(23.37,64.18) v1(23.5,48.38) v1(23.62,41.42) v1(23.62,39.95) v1(23.62,38.44) v1(23.62,37.09) v1(23.62,35.99) v1(23.62,34.66) v1(23.62,33.22) v1(23.62,31.63) v1(23.62,29.97) v1(23.62,28.53) v1(23.75,27.59) v1(23.75,22.98) v1(23.75,21.68) v1(23.75,20.33) v1(24.52,48.38) v1(24.51,46.09) v1(25.27,60.95) v1(25.68,48.38) v1(25.68,46.16) v1(25.78,72.38) v1(25.78,71.22) v1(25.78,70.15) v1(25.78,68.58) v1(25.78,67.32) v1(25.78,65.66) v1(25.78,64.21) v1(25.91,62.6) v1(25.91,62.6) v1(25.91,13.75) v1(25.91,12.69) v1(25.91,11.7) v1(25.91,10.46) v1(25.91,9.29) v1(26.16,35.31) v1(26.16,34.04) v1(26.16,32.88) v1(26.16,31.4) v1(26.16,29.99) v1(26.16,22.98) v1(26.16,21.72) v1(26.16,17.9) v1(26.16,15.74) v1(26.42,54.09) v1(26.7,42.79) v1(26.7,41.52) v1(26.7,40.04) v1(26.7,38.6) v1(26.7,37.09) v1(27.1,48.42) v1(27.1,46.16) v1(27.31,53.33) v1(27.81,42.79) v1(27.94,55.49) v1(27.94,52.57) v1(28.7,54.73) v1(28.83,51.81) v1(29.05,42.79) v1(29.2,48.42) v1(29.2,46.19) v1(29.46,51.04) v1(29.59,53.97) v1(29.97,50.41) v1(29.97,34.03) v1(30.22,42.79) v1(30.35,13.71) v1(30.35,12.7) v1(30.35,11.66) v1(30.35,10.48) v1(30.35,9.51) v1(30.48,27.93) v1(30.61,53.08) v1(30.73,49.65) v1(30.73,31.87) v1(30.99,28.44) v1(31.37,52.31) v1(31.47,42.79) v1(31.5,32.63) v1(31.5,21.07) v1(31.5,17.75) v1(31.5,16.06) v1(32,48.33) v1(32,46.19) v1(32,9.01) v1(32.13,51.55) v1(32.13,10.78) v1(32.16,13.75) v1(32.16,12.54) v1(32.16,11.53) v1(32.64,22.09) v1(33.66,23.1) v1(33.96,39.83) v1(34.67,23.99) v1(36.07,13.84) v1(36.07,12.49) v1(36.07,11.43) v1(36.07,10.29) v1(36.07,9.13) v1(36.19,17.9) v1(36.19,15.99) v1(36.7,32.25) v1(37.21,35.53) v1(37.21,34.03) v1(37.21,20.82) v1(38.1,17.9) v1(38.07,15.99) v1(38.21,39.83) v1(38.86,70.98) v1(38.99,30.09) v1(38.99,19.42) v1(39.62,17.9) v1(39.55,15.99) v1(41.28,30.98) v1(43.05,13.07) v1(43.81,20.31) v1(44.2,64.38) v1(44.2,63.35) v1(44.2,61.75) v1(44.2,60.46) v1(44.2,59.26) v1(44.2,57.91) v1(44.2,56.06) v1(44.32,65.65) v1(44.32,13.96) v1(45.09,39.43) v1(45.21,14.72) v1(45.34,66.67) v1(45.5,42.03) v1(45.59,57.8) v1(45.59,56.5) v1(45.62,55.25) v1(45.62,54.11) v1(45.97,38.72) v1(46.6,43.68) v1(46.61,42.03) v1(46.74,67.94) v1(46.86,10.15) v1(47.12,16.63) v1(47.75,43.68) v1(47.75,42.03) v1(47.88,17.52) v1(47.88,11.04) v1(48.39,39.23) v1(48.39,38.09) v1(48.51,69.71) v1(48.64,18.79) v1(48.64,11.8) v1(48.74,15.82) v1(49.28,29.33) v1(49.53,42.03) v1(49.53,39.23) v1(49.53,34.03) v1(49.83,50.97) v1(49.83,38.09) v1(49.83,36.35) v1(49.83,34.88) v1(50.04,71.11) v1(50.16,57.92) v1(50.16,56.76) v1(50.16,28.31) v1(50.42,29.96) v1(50.65,50.97) v1(50.93,43.68) v1(50.95,42.03) v1(51.05,72.25) v1(51.44,28.86) v1(51.44,27.68) v1(51.56,34.15) v1(51.82,38.09) v1(51.82,36.31) v1(51.82,9.77) v1(51.94,73.14) v1(52.44,43.52) v1(52.44,42.03) v1(52.44,39.45) v1(52.58,72.38) v1(52.83,55.21) v1(52.83,54.22) v1(52.96,10.91) v1(53.34,71.49) v1(53.34,37.96) v1(53.34,27.93) v1(53.47,39.49) v1(53.72,42.03) v1(53.85,11.8) v1(54.1,15.36) v1(54.23,70.6) v1(54.99,69.71) v1(55.04,37.96) v1(55.04,37) v1(55.12,20.18) v1(55.12,18.91) v1(55.75,69.2) v1(56.01,68) v1(56.01,66.96) v1(56.01,65.64) v1(56.01,64.67) v1(56.01,63.22) v1(56.01,62.09) v1(56.01,61.25) v1(56.01,59.17) v1(56.01,58.2) v1(56.01,57.07) v1(56.01,55.94) v1(56.01,54.93) v1(56.01,53.52) v1(59.06,16.37) v1(59.18,23.14) v1(59.18,21.48) v1(59.18,20.06) v1(59.18,18.53) v1(60.29,39.83) v1(61.89,39.83) v1(62.87,36.82) v1(64.13,69.97) v1(64.17,68.75) v1(64.26,67.68) v1(64.64,44.69) v1(65.53,71.11) v1(65.53,69.95) v1(65.53,68.75) v1(66.04,45.96) v1(66.55,11.42) v1(66.55,10.28) v1(67.18,47.11) v1(67.94,58.79) v1(67.94,57.6) v1(67.94,54.08) v1(67.94,52.98) v1(67.94,51.69) v1(67.94,50.09) v1(67.94,48.55) v1(69.22,52.69) v1(69.34,56.38) v1(69.85,16.12) v1(69.85,14.59) v1(69.85,13.05) v1(69.98,51.93) v1(70.1,26.34) v1(70.1,25.19) v1(70.1,24.2) v1(70.1,22.55) v1(70.1,21.52) v1(70.1,20.43) v1(70.1,19.42) v1(70.11,17.5) v1(70.23,55.49) v1(70.49,45.33) v1(70.87,50.79) v1(70.99,54.6) v1(71.12,7.74) v1(71.37,22.6) v1(71.5,46.22) v1(71.5,24.25) v1(71.63,19.42) v1(71.62,17.5) v1(71.75,53.71) v1(71.75,50.03) v1(71.75,10.28) v1(71.75,7.08) v1(72.01,42.41) v1(72.52,54.09) v1(72.52,24.25) v1(72.64,47.11) v1(72.77,49.01) v1(72.77,9.01) v1(72.88,22.6) v1(73.07,19.42) v1(73.07,17.5) v1(73.15,68.57) v1(73.15,68.57) v1(73.15,43.3) v1(73.41,54.47) v1(73.53,48) v1(73.66,67.94) v1(73.66,9.9) v1(74.17,44.44) v1(74.17,19.42) v1(74.17,17.54) v1(74.29,67.17) v1(74.26,22.6) v1(74.29,6.97) v1(74.38,28.18) v1(74.42,10.78) v1(74.55,54.98) v1(74.68,51.3) v1(74.94,45.33) v1(75.18,7.61) v1(75.31,11.55) v1(75.44,52.31) v1(75.95,55.36) v1(76.01,22) v1(76.2,8.63) v1(76.71,55.87) v1(76.84,44.82) v1(76.78,28.18) v1(76.96,72.25) v1(77.04,52.31) v1(77.09,13.71) v1(77.22,9.64) v1(77.47,63.74) v1(77.53,22) v1(77.6,71.49) v1(77.72,43.93) v1(77.98,53.08) v1(78.61,46.98) v1(78.61,11.42) v1(78.74,43.3) v1(78.99,54.09) v1(79.5,46.47) v1(79.63,42.15) v1(79.76,69.46) v1(79.76,67.91) v1(80.01,61.71) v1(80.26,45.46) v1(80.63,67.91) v1(80.65,65.39) v1(80.77,60.82) v1(80.77,41.01) v1(80.9,58.03) v1(81.15,44.69) v1(81.53,59.93) v1(81.66,57.14) v1(82.04,43.68) v1(82.3,56.5) v1(82.55,61.33) v1(82.68,58.79) v1(82.8,42.79) v1(82.8,22.98) v1(82.8,21.96) v1(82.8,20.94) v1(82.8,19.99) v1(82.8,18.8) v1(83.06,63.11) v1(83.06,55.62) v1(83.69,60.19) v1(83.69,57.78) v1(83.95,54.85) v1(84.07,62.35) v1(84.2,75.68) v1(84.25,73.91) v1(84.25,72.5) v1(84.71,56.76) v1(84.71,53.97) v1(85.09,61.46) v1(85.09,58.79) v1(85.22,73.91) v1(85.19,72.5) v1(85.29,75.68) v1(85.31,22.98) v1(85.34,21.71) v1(85.34,20.87) v1(85.34,19.77) v1(85.34,18.55) v1(85.6,55.74) v1(86.13,73.91) v1(86.11,72.5) v1(86.11,64.83) v1(86.16,75.68) v1(86.23,69.55) v1(86.23,60.44) v1(87.25,59.43) v1(87.88,58.66) v1(88.9,57.9) v1(89.66,56.89)
VBAT: length 31.2
  Top Layer w0.3: U1.6 39.84,34.79 34.27,34.79
  Top Layer w0.32: 34.27,34.41 34.27,34.79
  Top Layer w0.5: 34.27,34.79 v1(34.27,35.55)
  Bottom Layer w0.5: v1(34.27,35.55) 33.26,35.55 19.54,21.83 H5.2
VDDA: length 39.5
  Top Layer w0.3: C4.2 51.69,23.47 53.72,21.44 v1(53.72,20.06) 53.72,16.25 52.58,15.1 47.5,15.1 39.84,7.44 H6.18 ; U1.22 47.12,30.75 47.12,27.79 51.44,23.47
  Bottom Layer w0.254: R7.2 v1(53.72,20.06)
VIN: length 31.3
  Top Layer w0.6: v2(9.27,37.58) 7.39,37.58 USB1.11
  Top Layer w0.65: USB1.2 8.75,42.4 9.53,43.17 9.53,44.82 8.25,46.09 v1(6.73,46.09)
  Top Layer w0.75: SW1.2 4.19,46.84 4.94,46.09 v1(6.73,46.09)
  Top Layer w0.8: SW1.2 SW1.5
  Bottom Layer w0.5: SW1.2 4.19,46.85 4.95,46.09 v1(6.73,46.09)
  Bottom Layer w0.6: v1(6.73,46.09) 8.13,46.09 9.27,44.95 v2(9.27,37.58)
BOOT0: length 43.2
  Top Layer w0.254: v1(44.58,41.14) 44.58,41.18 U1.94 ; R13.2 72.77,25.21 v1(73.53,24.45) 74.29,23.68 SW3.1
  Bottom Layer w0.254: v1(73.53,24.45) 56.84,41.14 v1(44.58,41.14)
BOOT1/PB2: length 80.3
  Top Layer w0.254: R14.2 80.9,26.04 80.9,24.75 v1(80.37,24.23) 79.83,23.68 78.1,23.68 ; H6.29 56.39,4.04 56.39,7.74 64.19,15.53 64.19,27.37 58.93,32.63 56.66,32.63 53.34,35.95 v1(53.34,36.06)
  Bottom Layer w0.254: v1(53.34,36.06) 66.04,23.36 79.5,23.36 v1(80.37,24.23)
PA0: length 44.6
  Top Layer w0.254: H6.17 41.15,4.04 41.15,7.99 47.73,14.57 54.59,14.57 56.94,16.93 56.94,20.39 51.69,25.64 50.04,25.64 47.62,28.06 47.62,30.55 U1.23
PA1: length 40.9
  Top Layer w0.254: H6.20 42.27,5.38 42.27,8.47 47.88,14.09 54.73,14.09 57.43,16.78 57.43,20.54 51.82,26.15 50.29,26.15 48.01,28.44 48.01,30.23 U1.24
PA2: length 43.2
  Top Layer w0.254: 48.9,30.42 48.39,29.9 48.39,28.82 50.55,26.66 51.94,26.66 57.91,20.69 57.91,16.5 55.01,13.6 48.03,13.6 43.64,9.21 43.64,3.99 H6.19
PA3: length 37.8
  Top Layer w0.254: H6.22 45.02,5.37 45.02,9.95 48.18,13.11 55.16,13.11 58.4,16.36 58.4,20.84 52.32,26.91 52.32,29.19 51.1,30.42
PA4: length 42.7
  Top Layer w0.254: U1.29 55.07,28.56 57.91,28.56 60.59,25.88 60.59,17.02 52.2,8.63 48.26,8.63 46.23,6.59 46.23,4.18 44.92,2.87 H6.21
PA5: length 38.9
  Top Layer w0.254: H6.24 47.46,5.92 49.66,8.12 52.32,8.12 61.04,16.84 61.04,26.07 58.04,29.07 55.27,29.07 U1.30
PA6: length 41.8
  Top Layer w0.254: H6.23 48.77,4.04 48.77,6.34 50.04,7.61 52.45,7.61 61.49,16.65 61.49,26.26 58.17,29.58 55.47,29.58 U1.31
PA7: length 38
  Top Layer w0.254: H6.26 50,5.67 51.44,7.1 52.58,7.1 61.94,16.46 61.94,26.44 58.29,30.09 55.67,30.09 U1.32
PA8: length 30.6
  Top Layer w0.254: H7.31 57.53,74.64 57.53,72.38 58.8,71.11 58.8,51.63 U1.67
PA9: length 33.4
  Top Layer w0.254: H7.32 56.39,76.04 56.39,72.76 58.29,70.86 58.29,51.83 U1.68
PA10: length 30.3
  Top Layer w0.254: U1.69 57.78,52.03 57.78,70.47 55.12,73.14 55.12,74.69 H7.29
PA15: length 34.2
  Top Layer w0.254: U1.77 43.05,54.73 43.05,65.73 51.31,73.99 51.31,76.04 H7.28
PB0: length 40.5
  Top Layer w0.254: H6.27 53.85,4.04 53.85,6.47 63.29,15.91 63.29,27 58.67,31.61 56.27,31.61 U1.35
PB1: length 37.4
  Top Layer w0.254: H6.30 55.08,7.06 63.74,15.72 63.74,27.19 58.8,32.12 56.47,32.12 U1.36
PB3: length 36.2
  Top Layer w0.254: 44.31,44.98 36.96,52.34 36.96,72.25 36.07,73.14 36.07,76.04 H7.16
PB4: length 33.9
  Top Layer w0.254: U1.90 36.45,52.14 36.45,72 34.8,73.65 34.8,74.69 H7.13
PB5: length 37.7
  Top Layer w0.254: U1.91 35.94,51.94 35.94,70.6 33.53,73.02 33.53,76.04 H7.14
PB6: length 35.4
  Top Layer w0.254: U1.92 35.43,51.74 35.43,70.35 32.22,73.56 H7.11
PB7: length 39.1
  Top Layer w0.254: U1.93 34.93,51.54 34.93,69.71 30.99,73.65 30.99,76.04 H7.12
PB8: length 37
  Top Layer w0.254: U1.95 34.42,50.63 34.42,69.46 29.68,74.19 H7.9
PB9: length 41.3
  Top Layer w0.254: U1.96 33.91,50.43 33.91,69.25 29.88,73.27 29.08,73.27 28.45,73.9 28.45,76.04 H7.10
PB10: length 40.9
  Top Layer w0.254: H6.39 69.09,4.04 69.09,8.63 68.65,9.07 68.65,29.22 61.17,36.69 59.67,36.69 U1.47
PB11: length 38.5
  Top Layer w0.254: U1.48 60,37.07 61.47,37.07 69.12,29.42 69.12,9.35 70.32,8.15 H6.42
PB12: length 54.5
  Top Layer w0.254: 59.58,41.1 66.93,48.44 66.93,63.62 77.94,74.63 H7.47
  Top Layer w0.32: U4.1 v1(85.22,69.97)
  Bottom Layer w0.32: H7.47 77.94,72.42 80.39,69.97 v1(85.22,69.97)
PB13: length 62.7
  Top Layer w0.254: U1.52 66.42,48.64 66.42,63.83 76.71,74.11 76.71,76.04 H7.48
  Top Layer w0.32: 89.65,67.43 v1(87.38,67.43)
  Bottom Layer w0.32: v1(87.38,67.43) 87.38,69.84 85.85,71.36 80.52,71.36 79.25,72.63 79.25,75.96 H7.48
PB14: length 54.8
  Top Layer w0.254: U1.53 65.91,48.84 65.91,64.04 75.4,73.53 H7.45
  Top Layer w0.32: U4.2 v1(84.58,68.7)
  Bottom Layer w0.32: H7.45 75.4,72.42 79.12,68.7 v1(84.58,68.7)
PB15: length 65.9
  Top Layer w0.254: U1.54 65.41,49.04 65.41,64.25 74.17,73.01 74.17,76.04 H7.46
  Top Layer w0.32: U4.5 v1(86.49,66.16)
  Bottom Layer w0.32: v1(86.49,66.16) 79.76,66.16 74.17,71.75 74.17,76.04 H7.46
PC0: length 34.1
  Top Layer w0.254: v1(43.94,31.49) 43.94,32.53 U1.15
  Bottom Layer w0.254: v1(43.94,31.49) 43.94,31.23 33.02,20.31 33.02,6.07 H6.12
PC1: length 36.5
  Top Layer w0.254: U1.16 44.7,32.58 v1(44.7,32.25)
  Bottom Layer w0.254: H6.11 33.53,4.04 33.53,20.18 44.7,31.36 v1(44.7,32.25)
PC2: length 37.7
  Top Layer w0.254: U1.17 47.37,34.54 v1(47.37,34.92)
  Bottom Layer w0.254: v1(47.37,34.92) 45.59,33.14 45.59,31.61 34.04,20.06 34.04,5.99 H6.14
PC3: length 76.5
  Top Layer w0.254: 45.97,27.66 45.21,28.42 v1(45.21,30.13) 45.21,31.68 U1.18
  Top Layer w0.32: v1(49.02,36.69) 49.02,35.49 U1.18
  Top Layer w0.35: 25.4,56.5 38.1,43.81 v1(38.1,42.79)
  Bottom Layer w0.254: v1(45.21,30.13) 44.87,30.13 34.54,19.8 34.54,7.61 36.07,6.09 36.07,4.04 H6.13
  Bottom Layer w0.35: v1(38.1,42.79) 44.2,36.69 v1(49.02,36.69)
PC4: length 41
  Top Layer w0.254: H6.25 50.24,2.73 51.31,3.8 51.31,5.83 52.07,6.59 52.71,6.59 62.39,16.28 62.39,26.63 58.42,30.6 55.87,30.6 U1.33
PC5: length 37.4
  Top Layer w0.254: U1.34 56.07,31.11 58.55,31.11 62.84,26.81 62.84,16.09 52.54,5.79 H6.28
PC6: length 32.4
  Top Layer w0.254: U1.63 60.83,50.83 60.83,71.25 62.7,73.12 H7.35
PC7: length 34.8
  Top Layer w0.254: 54.99,45.69 60.32,51.03 60.32,71.49 61.47,72.63 61.47,76.04 H7.36
PC8: length 31
  Top Layer w0.254: U1.65 59.82,51.23 59.82,74.39 H7.33
PC9: length 33.6
  Top Layer w0.254: H7.34 58.93,76.04 58.93,71.87 59.31,71.49 59.31,51.43 U1.66
PC10: length 31.3
  Top Layer w0.254: H7.25 50,73.4 42.54,65.94 42.54,54.53 U1.78
PC11: length 34.5
  Top Layer w0.254: U1.79 42.04,54.33 42.04,66.15 48.77,72.88 48.77,76.04 H7.26
PC12: length 31.5
  Top Layer w0.254: H7.23 47.46,72.29 41.53,66.36 41.53,54.13 U1.80
PC13: length 44.2
  Top Layer w0.254: H6.9 30.17,2.73 30.99,3.55 30.99,7.19 29.43,8.75 29.43,29.16 33.53,33.26 39.02,33.26 U1.7
PD0: length 34.7
  Top Layer w0.254: U1.81 41.02,53.93 41.02,66.62 46.23,71.83 46.23,75.94 47.46,77.17 H7.24
PD1: length 31.7
  Top Layer w0.254: U1.82 40.51,53.73 40.51,66.84 44.92,71.24 H7.21
PD2: length 34.9
  Top Layer w0.254: U1.83 40,53.53 40,67.05 43.69,70.73 43.69,76.04 H7.22
PD3: length 31.9
  Top Layer w0.254: U1.84 39.5,53.33 39.5,67.3 42.38,70.18 H7.19
PD4: length 35.1
  Top Layer w0.254: U1.85 38.99,53.13 38.99,67.55 41.15,69.71 41.15,76.04 H7.20
PD5: length 32.1
  Top Layer w0.254: U1.86 38.48,52.93 38.48,67.81 39.84,69.17 H7.17
PD6: length 35.3
  Top Layer w0.254: H7.18 38.61,76.04 38.61,73.27 37.97,72.63 37.97,52.73 45.01,45.69
PD7: length 32.4
  Top Layer w0.254: U1.88 37.47,52.53 37.47,74.56 H7.15
PD8: length 67.8
  Top Layer w0.254: H7.43 72.86,72.42 64.9,64.46 64.9,49.24 U1.55 ; SW6.2 v1(90.3,54.41)
  Bottom Layer w0.254: H7.43 72.86,72.1 90.3,54.66 v1(90.3,54.41)
PD9: length 84.1
  Top Layer w0.254: U1.56 64.39,49.44 64.39,64.67 71.63,71.91 71.63,76.04 H7.44 ; SW5.2 88.65,46.41 v1(88.65,54.22)
  Bottom Layer w0.254: H7.44 71.63,76.04 71.63,71.24 v1(88.65,54.22)
PD10: length 89.3
  Top Layer w0.254: H7.41 70.32,71.32 63.88,64.88 63.88,49.64 U1.57 ; v1(87.63,52.57) 87.63,35.87 SW4.2
  Bottom Layer w0.254: v1(87.63,52.57) 70.32,69.88 H7.41
PD11: length 54.1
  Top Layer w0.254: LED2.1 71.7,64.89 v1(70.1,64.89) ; U1.58 63.37,49.84 63.37,65.27 69.09,70.98 69.09,76.04 H7.42
  Bottom Layer w0.254: v1(70.1,64.89) 69.09,65.9 69.09,76.04 H7.42
PD12: length 52.5
  Top Layer w0.254: v1(70.1,61.2) 70.21,61.31 LED3.1 ; U1.59 62.87,50.04 62.87,70.22 65.02,72.38 66.68,72.38 67.69,73.4 67.69,74.64 H7.39
  Bottom Layer w0.254: v1(70.1,61.2) 67.78,63.53 H7.39
PD13: length 61.3
  Top Layer w0.254: LED4.1 71.65,57.9 v1(70.23,57.9) ; H7.40 66.55,76.04 66.55,73.52 66.04,73.02 64.9,73.02 62.36,70.47 62.36,50.24 U1.60
  Bottom Layer w0.254: H7.40 66.55,76.04 66.55,61.58 v1(70.23,57.9)
PD14: length 33.9
  Top Layer w0.254: U1.61 61.85,50.44 61.85,70.73 65.24,74.12 H7.37
PD15: length 36.2
  Top Layer w0.254: 55.69,44.98 61.34,50.63 61.34,70.98 64.01,73.65 64.01,76.04 H7.38
PE0: length 39.6
  Top Layer w0.254: H7.7 27.18,74.69 27.18,73.4 27.81,72.76 29.67,72.76 33.4,69.03 33.4,50.23 U1.97
PE1: length 43.5
  Top Layer w0.254: H7.8 25.91,76.04 25.91,73.78 27.43,72.25 29.46,72.25 32.89,68.82 32.89,50.04 U1.98
PE2: length 46
  Top Layer w0.254: 40.42,38.9 39.86,38.34 30.02,38.34 26.92,35.25 26.92,8.88 24.6,6.56 H6.6
PE3: length 48.3
  Top Layer w0.254: U1.2 40.06,37.84 30.23,37.84 27.43,35.04 27.43,8.63 25.91,7.1 25.91,4.04 H6.5
PE4: length 44.5
  Top Layer w0.254: H6.8 27.14,7.56 27.94,8.36 27.94,34.83 30.44,37.33 40.26,37.33 U1.3
PE5: length 46.8
  Top Layer w0.254: H6.7 28.45,4.04 28.45,34.66 30.61,36.82 40.46,36.82 U1.4
PE6: length 43.6
  Top Layer w0.254: H6.10 29.68,7.61 28.96,8.33 28.96,34.45 30.82,36.31 40.66,36.31 U1.5
PE7: length 37.4
  Top Layer w0.254: H6.32 57.62,8.33 64.63,15.35 64.63,27.56 59.06,33.14 56.86,33.14 U1.38
PE8: length 40.5
  Top Layer w0.254: H6.31 58.93,4.04 58.93,9.01 65.08,15.16 65.08,27.74 59.18,33.64 57.06,33.64 55.69,35.02
PE9: length 37.5
  Top Layer w0.254: U1.40 57.39,34.03 59.44,34.03 65.53,27.93 65.53,14.94 60.16,9.57 H6.34
PE10: length 40.5
  Top Layer w0.254: H6.33 61.47,4.04 61.47,10.28 65.98,14.79 65.98,28.12 59.69,34.41 57.71,34.41 U1.41
PE11: length 37.5
  Top Layer w0.254: H6.36 62.7,10.87 66.43,14.6 66.43,28.3 59.94,34.79 58.04,34.79 U1.42
PE12: length 40.6
  Top Layer w0.254: H6.35 64.01,4.04 64.01,11.55 66.88,14.42 66.88,28.49 60.2,35.17 58.37,35.17 U1.43
PE13: length 37.5
  Top Layer w0.254: U1.44 58.69,35.55 60.45,35.55 67.33,28.67 67.33,14.23 65.28,12.18 65.28,5.31 H6.38
PE14: length 40.6
  Top Layer w0.254: H6.37 66.55,4.04 66.55,8.12 67.78,9.35 67.78,28.86 60.71,35.93 59.02,35.93 U1.45
PE15: length 37.5
  Top Layer w0.254: H6.40 67.78,8.63 68.2,9.05 68.2,29.04 60.92,36.31 59.34,36.31 U1.46
RST: length 49.3
  Top Layer w0.254: SW2.2 81.09,15.87 79.95,17.01 C14.2 v1(78.09,18.53) R3.1 ; 45.01,34.31 v1(46.35,35.65) 46.35,35.68
  Bottom Layer w0.254: v1(78.09,18.53) 68.45,18.53 51.34,35.65 v1(46.35,35.65)
SWCLK: length 12.7
  Top Layer w0.254: 48.9,49.58 46.48,52 46.48,55.49 49.02,58.03 H9.2
SWDIO: length 13.4
  Top Layer w0.254: H9.3 51.56,57.65 53.97,55.23 53.97,50.34 U1.72
USB_D+: length 82.5
  Top Layer w0.254: USB1.6 6.6,40.25 6.35,40 6.35,39.5 6.6,39.25 USB1.8 8.1,39.25 8.15,39.3 18.86,39.3 v1(18.92,39.36) ; H7.27 52.54,74.07 56.77,69.84 56.77,52.43 U1.71 51.95,47.61 51.95,47.47 50.41,45.92 50.41,44.94 v1(50.29,44.82)
  Bottom Layer w0.254: v1(50.29,44.82) 50.06,45.05 25.34,45.05 19.83,39.54 19.53,39.54 19.36,39.36 v1(18.92,39.36)
USB_D-: length 85.9
  Top Layer w0.254: 8.64,39.74 8.51,39.87 8.51,40.5 8.26,40.75 USB1.5 ; 8.64,39.74 8.6,39.7 8.15,39.7 8.11,39.74 ; 8.64,39.74 8.67,39.7 18.38,39.7 v1(18.8,40.12) ; 8.11,39.74 8,39.74 7.99,39.75 ; 8.11,39.74 8.1,39.75 7.99,39.75 ; USB1.7 7.99,39.75 ; v1(51.18,44.95) 50.81,45.32 50.81,45.83 52.24,47.26 52.31,47.26 U1.70 57.28,52.23 57.28,70.09 53.85,73.52 53.85,76.04 H7.30
  Bottom Layer w0.254: v1(18.8,40.12) 19.36,40.12 19.53,39.94 19.66,39.94 25.17,45.46 50.67,45.46 v1(51.18,44.95)
VREF+: length 39.4
  Top Layer w0.3: U1.21 46.61,30.95 46.61,26.14 50.36,22.39 v1(50.36,19.91) 50.36,18.72 38.61,6.97 38.61,3.93 37.41,2.73 H6.15
  Bottom Layer w0.254: R8.2 v1(50.36,19.91) R9.1
VREF-: length 34
  Top Layer w0.254: U1.20 45.97,31.02 v1(45.97,30.72)
  Bottom Layer w0.254: H6.16 37.3,5.62 35.05,7.86 35.05,19.68 43.8,28.42 R11.2 45.7,28.42 45.97,28.69 v1(45.97,30.72)
XIN: length 11.7
  Top Layer w0.254: 34.08,31.86 35.31,30.64 X2.1 37.1,30.64 U1.8
XOUT: length 11.6
  Top Layer w0.254: U1.9 37.07,29.9 X2.2 37.07,28.76 C15.2
XT2IN: length 18
  Top Layer w0.254: C11.2 42.32,22.04 X1.2 41.67,22.71 43.56,24.6 43.56,29.45 42.8,30.22 42.8,33.51 44.31,35.02
XT2OUT: length 17.4
  Top Layer w0.254: C12.2 45.47,22.39 X1.1 45.77,22.8 43.94,24.63 43.94,29.58 43.18,30.34 43.18,33.18 U1.13
$1N1179: length 3.2
  Top Layer w0.6: LED1.2 12.05,48.31 R2.2
$1N8998: length 12.3
  Top Layer w0.5: H5.3 12.32,12.82 B1.1
$1N11842: length 2.6
  Top Layer w0.254: R15.2 73.93,64.9 LED2.2
$1N11913: length 2.6
  Top Layer w0.254: R16.2 76.52,61.31 LED3.2
$1N11966: length 2.6
  Top Layer w0.254: R17.2 76.52,57.83 LED4.2
$1N16330: length 8.1
  Top Layer w0.254: R1.1 4.83,32.61 4.83,37.45 5.59,38.22 7.34,38.22 USB1.10
$1N16369: length 15.4
  Top Layer w0.254: R18.1 1.92,32.14 4.44,34.66 4.44,39.87 5.84,41.27 7.36,41.27 USB1.4

## Copper pours and planes (outline as drawn; the poured copper is in the pictures)
GND on Top Layer: -2.03,81.78 100.97,81.78 100.97,-1.66 -2.03,-1.66
GND on Bottom Layer: -9.78,86.22 109.47,86.22 109.47,-3.06 -9.78,-3.06

Small or netless copper shapes (teardrops, artwork), in the pictures only: 422 on Top Layer, 80 on Bottom Layer

## Text on the board
Bottom Silkscreen Layer: GND | VREF- | VREF+ | 3.29V | 3.3V | VDDA | https://blog.zeruns.tech | CH32V307VCT6 / 最小系统
Top Silkscreen Layer: BOOT0 | BOOT1 | 1.25V | PC3/ / ADC13 | GND | SWCLK | SWDIO | 3.3V | VBAT | BAT | 5V | PE2 | PE3 | PE5 | PE4 | PE0 | PE1 | PE6 | PC13 | PB9 | PB8 | PB7 | PC0 | PC1 | PB6 | PC2 | PB4 | PC3 | PB5 | VREF- | VREF+ | PB3 | PD7 | PD5 | PD6 | VDDA | PA0 | PA2 | PD4 | PD3 | PA1 | PA3 | PA4 | PD2 | PD1 | PC12 | PA5 | PA6 | PD0 | PC11 | PA7 | PC10 | PC4 | PB0 | PA15 | PC5 | PA12 | PB1 | PB2 | PA11 | PA10 | PE7 | PE8 | PA9 | PA8 | PE10 | PE9 | PC9 | PC8 | PE12 | PE11 | PC6 | PC7 | PE14 | PD15 | PE13 | PD14 | PD12 | PE15 | PB10 | PD13 | PD10 | PB11 | PD11 | PD8 | PD9 | PB15 | PB14 | PB12 | PB13 | Reset | KEY1 | KEY3 | KEY2
